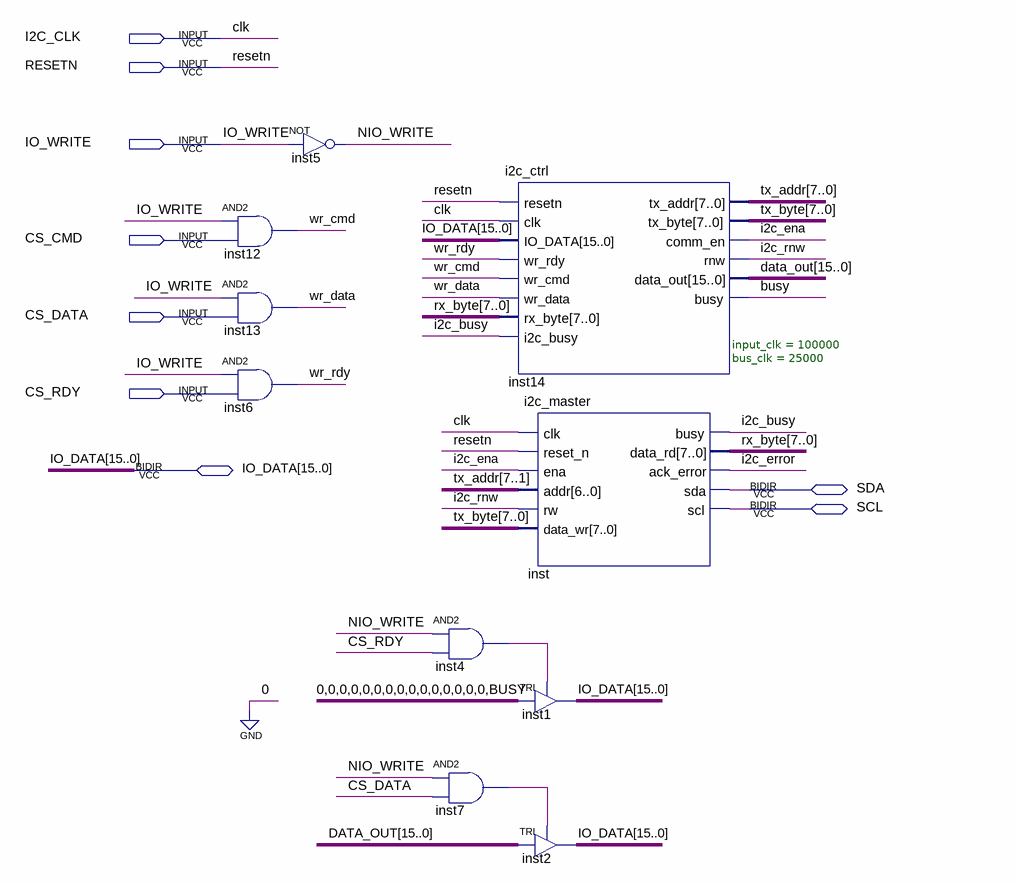
[diagram p0: schematic sheet]
// Quartus schematic I2C_INTERFACE.bdf as structural Verilog: 10 symbols, 9 pins
module I2C_INTERFACE (
  input  I2C_CLK,
  input  RESETN,
  input  IO_WRITE,
  input  CS_CMD,
  input  CS_DATA,
  input  CS_RDY,
  inout  [15:0] IO_DATA,
  inout  SDA,
  inout  SCL
);

  wire BUSY, i2c_busy, i2c_ena, i2c_error, i2c_rnw, inst4_out, inst7_out, NIO_WRITE, wr_cmd, wr_data, wr_rdy;
  wire [7:0] rx_byte, tx_addr, tx_byte;
  wire [15:0] data_out;

  and inst12 (wr_cmd, IO_WRITE, CS_CMD);
  and inst13 (wr_data, IO_WRITE, CS_DATA);
  and inst6 (wr_rdy, IO_WRITE, CS_RDY);
  not inst5 (NIO_WRITE, IO_WRITE);
  and inst4 (inst4_out, NIO_WRITE, CS_RDY);
  and inst7 (inst7_out, NIO_WRITE, CS_DATA);
  i2c_ctrl inst14 (
    .resetn(RESETN), .clk(I2C_CLK), .IO_DATA(IO_DATA), .wr_rdy(wr_rdy), .wr_cmd(wr_cmd), .wr_data(wr_data),
    .rx_byte(rx_byte), .i2c_busy(i2c_busy), .tx_addr(tx_addr), .tx_byte(tx_byte), .comm_en(i2c_ena),
    .rnw(i2c_rnw), .data_out(data_out), .busy(BUSY));
  i2c_master #(.input_clk(100000), .bus_clk(25000)) inst (
    .clk(I2C_CLK), .reset_n(RESETN), .ena(i2c_ena), .addr(tx_addr[7:1]), .rw(i2c_rnw), .data_wr(tx_byte),
    .busy(i2c_busy), .data_rd(rx_byte), .ack_error(i2c_error), .sda(SDA), .scl(SCL));
  TRI inst1[15:0] (.IN({{15{1'b0}}, BUSY}), .OE(inst4_out), .OUT(IO_DATA));
  TRI inst2[15:0] (.IN(data_out), .OE(inst7_out), .OUT(IO_DATA));

  // Other names for the same wires on the sheet: clk = I2C_CLK
endmodule
